# Altium schematic sheet Wifi.SchDoc
size A4; SheetNumber: 2; SheetTotal: 8
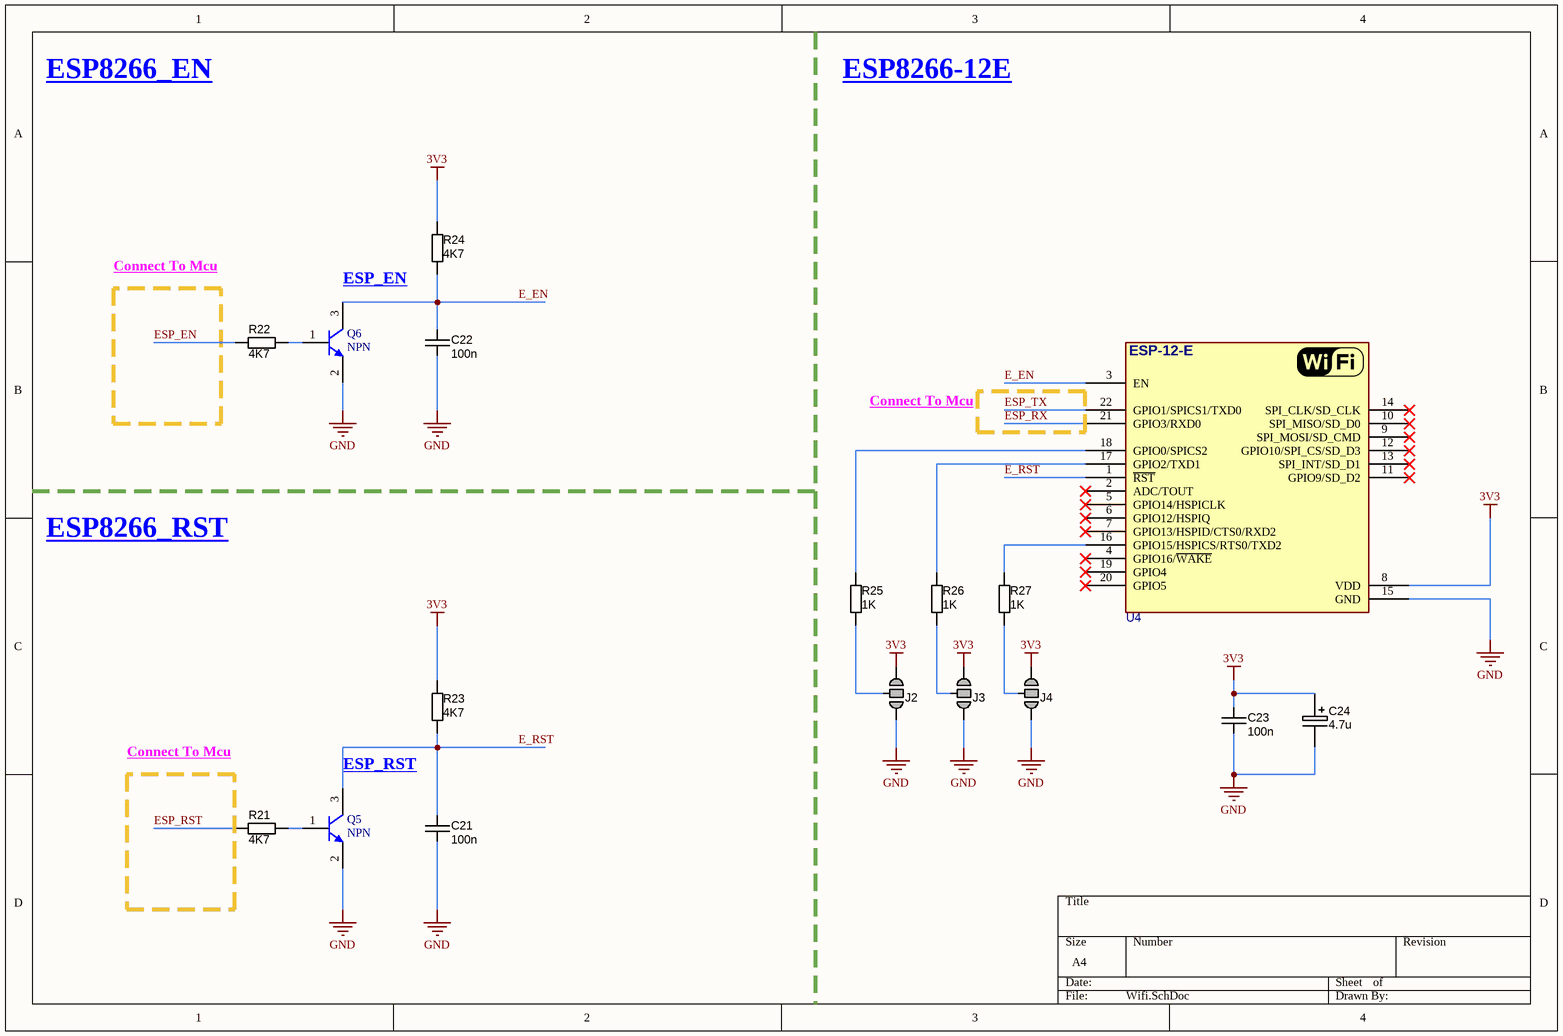
[diagram p0: Wifi.SchDoc]

## Parts
C21  value 100n  [CAPC1608X90N]  (hidden comment: approved sub OK)
C22  value 100n  [CAPC1608X90N]  (hidden comment: approved sub OK)
C23  value 100n  [CAPC1608X90N]  (hidden comment: approved sub OK)
C24  value 4.7u  [C_TN_3528]
J2  Jumper  [Jump_3Way]  (value not drawn)  (no BOM)
J3  Jumper  [Jump_3Way]  (value not drawn)  (no BOM)
J4  Jumper  [Jump_3Way]  (value not drawn)  (no BOM)
Q5  NPN  [SOT23-3]
Q6  NPN  [SOT23-3]
R21  value 4K7  [RESC1608X55N]  (hidden comment: Thick Film)
R22  value 4K7  [RESC1608X55N]  (hidden comment: Thick Film)
R23  value 4K7  [RESC1608X55N]  (hidden comment: Thick Film)
R24  value 4K7  [RESC1608X55N]  (hidden comment: Thick Film)
R25  value 1K  [RESC1608X55N]  (hidden comment: Thick Film)
R26  value 1K  [RESC1608X55N]  (hidden comment: Thick Film)
R27  value 1K  [RESC1608X55N]  (hidden comment: Thick Film)
U4  (no value)  [ESP8266_ESP12E]

## Nets
3V3: C23.1 C24.1 J2.3 J3.3 J4.3 R23.1 R24.1 U4.8(VDD)
GND: C21.2 C22.2 C23.2 C24.2 J2.1 J3.1 J4.1 Q5.2(E) Q6.2(E) U4.15(GND)
E_EN: C22.1 Q6.3(C) R24.2 U4.3(EN)
E_RST: C21.1 Q5.3(C) R23.2 U4.1(~{RST})
ESP_EN: R22.1
ESP_RST: R21.1
ESP_RX: U4.21(GPIO3/RXD0)
ESP_TX: U4.22(GPIO1/SPICS1/TXD0)
NetJ2_2: J2.2 R25.2
NetJ3_2: J3.2 R26.2
NetJ4_2: J4.2 R27.2
NetQ5_1: Q5.1(B) R21.2
NetQ6_1: Q6.1(B) R22.2
NetR25_1: R25.1 U4.18(GPIO0/SPICS2)
NetR26_1: R26.1 U4.17(GPIO2/TXD1)
NetR27_1: R27.1 U4.16(GPIO15/HSPICS/RTS0/TXD2)

Not connected (* = marked no-connect by the designer): U4 2(ADC/TOUT)* 4(GPIO16/~{WAKE})* 5(GPIO14/HSPICLK)* 6(GPIO12/HSPIQ)* 7(GPIO13/HSPID/CTS0/RXD2)* 9(SPI_MOSI/SD_CMD)* 10(SPI_MISO/SD_D0)* 11(GPIO9/SD_D2)* 12(GPIO10/SPI_CS/SD_D3)* 13(SPI_INT/SD_D1)* 14(SPI_CLK/SD_CLK)* 19(GPIO4)* 20(GPIO5)*

## Notes on the sheet
- ESP8266_EN
- ESP8266-12E
- Connect To Mcu
- ESP_EN
- ESP8266_RST
- ESP_RST
- (in symbol ESP8266 ESP-12-E) ESP-12-E

## Library data of the parts
C21-C23 = CAPC_100n_0603_X7R_50V_10%: Capacitor SMD Cer 100nF 10% 50V X7R 0603; Manufacturer 1: AVX Corporation; Manufacturer Part Number 1: 06035C104KAT2A; Ratings: 50V; X7R; Material: ceramic; SCDType: spec; Manufacturer 2: TDK Corporation; Manufacturer Part Number 2: C1608X7R1H104K; Package / Case: 0603 (1608 Metric); Tolerance: ±10%; Supplier 1: Digi-Key; Supplier Part Number 1: 478-5052-1-ND; ComponentLink1URL: http://www.avx.com/docs/Catalogs/cx7r.pdf; ComponentLink1Description: http://www.avx.com/docs/Catalogs/cx7r.pdf; Supplier 2: Digi-Key; Supplier Part Number 2: 445-1314-1-ND; ComponentLink2URL: http://product.tdk.com/capacitor/mlcc/en/documents/mlcc_commercial_general_en.pdf; ComponentLink2Description: http://product.tdk.com/capacitor/mlcc/en/documents/mlcc_commercial_general_en.pdf
C24 = CAPT_4u7_3216_16V: Capacitor SMD Tantalum 10uF 10% 16V 3216-18; Manufacturer 1: Vishay/Sprague; Manufacturer Part Number 1: 293D475X9016A2TE3; SCDType: undef; Package / Case: EIA 535BAAC size A; Ratings: 16V; Tolerance: ±10%; Material: Tantalum; Supplier 1: Digi-Key; Supplier Part Number 1: 718-1148-1-ND
J2-J4 = JUMP_3WAY: SMD jumper
Q5 Q6 = NPN: NPN Bipolar Transistor; Published: 8-Jun-2000; LatestRevisionDate: 17-Jul-2002; LatestRevisionNote: Re-released for DXP Platform.; PackageReference: TO-226-AA; Publisher: Altium Limited; PackageDescription: TO, Flat Index; 3 In-Line, Axial Leads; Body Dia. 4.8mm; Leads 0.55 x 0.51 mm (max); Code_JEDEC: TO-226-AA
R21-R24 = RES_4K7_0603_5%: Resistor SMD chip 4.7k Ohm 0.1W 5% 0603; Manufacturer 1: Vishay/Dale; Manufacturer Part Number 1: CRCW06034K70JNEA; Ratings: 1/10 W; SCDType: spec; Package / Case: 0603 (1608 metric); Tolerance: ±5%; Material: Thick Film; Supplier 1: Digi-Key; Supplier Part Number 1: 541-4.7KGCT-ND
R25-R27 = RES_4K7_0603_5%: Resistor SMD chip 1k Ohm 0.1W 5% 0603; Manufacturer 1: Vishay/Dale; Manufacturer Part Number 1: CRCW06034K70JNEA; Ratings: 1/10 W; SCDType: spec; Package / Case: 0603 (1608 metric); Tolerance: ±5%; Material: Thick Film; Supplier 1: Digi-Key; Supplier Part Number 1: 541-4.7KGCT-ND
U4 = ESP8266 ESP-12-E: ESP8266 ESP-12 Wi-Fi Module; ComponentLink1Description: Website Smart World; ComponentLink1URL: https://www.smartw.ir/; DatasheetVersion: 2021; ComponentLink2Description: Telegram; ComponentLink2URL: https://t.me/altium_smartw; ComponentLink3Description: Instagram; ComponentLink3URL: https://Instagram.com/smartgw.ir